# EAGLE design LEDs and Buttons (EAGLE 8.5.0)
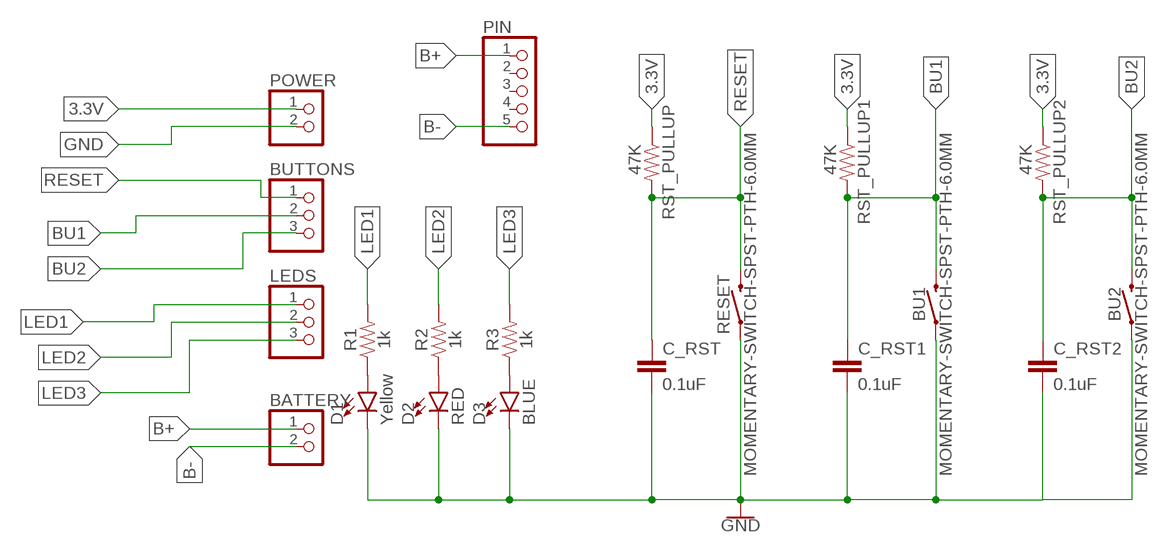
[diagram p0: schematic, sheet 1]

## Parts
BATTERY  PINHD-1X2  [1X02]
BU1  MOMENTARY-SWITCH-SPST-PTH-6.0MM  [TACTILE_SWITCH_PTH_6.0MM]
BU2  MOMENTARY-SWITCH-SPST-PTH-6.0MM  [TACTILE_SWITCH_PTH_6.0MM]
BUTTONS  PINHD-1X3  [1X03]
C_RST  0.1uF  22UF-0805-6.3V-20%  [0805]
C_RST1  0.1uF  22UF-0805-6.3V-20%  [0805]
C_RST2  0.1uF  22UF-0805-6.3V-20%  [0805]
D1  Yellow  LED-YELLOWLILYPAD  [LED-1206]
D2  RED  LED-RED1206  [LED-1206]
D3  BLUE  LED-BLUE1206  [LED-1206]
LEDS  PINHD-1X3  [1X03]
PIN  PINHD-1X55X2MM  [1_05X2MM]
POWER  PINHD-1X2  [1X02]
R1  1k  0.75OHM-0805-1/4W-1%  [0805]
R2  1k  0.75OHM-0805-1/4W-1%  [0805]
R3  1k  0.75OHM-0805-1/4W-1%  [0805]
RESET  MOMENTARY-SWITCH-SPST-PTH-6.0MM  [TACTILE_SWITCH_PTH_6.0MM]
RST_PULLUP  47K  RESISTOR0805  [0805]
RST_PULLUP1  47K  RESISTOR0805  [0805]
RST_PULLUP2  47K  RESISTOR0805  [0805]

## Nets
3.3V: POWER.1 RST_PULLUP1.1 RST_PULLUP2.1 RST_PULLUP.1
B+: BATTERY.1 PIN.1
B-: BATTERY.2 PIN.5
BU1: BU1.3 BUTTONS.2 C_RST1.1 RST_PULLUP1.2
BU2: BU2.3 BUTTONS.3 C_RST2.1 RST_PULLUP2.2
GND: BU1.1 BU2.1 C_RST1.2 C_RST2.2 C_RST.2 D1.C D2.C D3.C POWER.2 RESET.1
LED1: LEDS.1 R1.2
LED2: LEDS.2 R2.2
LED3: LEDS.3 R3.2
N$1: D1.A R1.1
N$2: D2.A R2.1
N$3: D3.A R3.1
RESET: BUTTONS.1 C_RST.1 RESET.3 RST_PULLUP.2
Unconnected: PIN.2 PIN.3 PIN.4

## Library data of the parts
BATTERY POWER = pinhead:PINHD-1X2: PIN HEADER
BU1 BU2 RESET = SparkFun-Switches:MOMENTARY-SWITCH-SPST: Momentary Switch (Pushbutton) - SPST Normally-open (NO) SPST momentary switches (buttons, pushbuttons). Variants PTH-12MM - 12mm square, through-hole Momentary Pushbutton Switch - 12mm Square <https://www.sparkfun.com/products/9190> (COM-09190) PTH-6.0MM, PTH-6.0MM-KIT - 6.0mm square, through-hole Mini Pushbutton Switch <https://www.sparkfun.com/products/97> (COM-00097) KIT package intended for soldering kit's - only one side of pads' copper is exposed. PTH-RIGHT-ANGLE-KIT - Right-angle, through-hole Right Angle Tactile Button <https://www.sparkfun.com/products/10791> - Used on SparkFun BigTime Watch Kit <https://www.sparkfun.com/products/11734> SMD-12MM - 12mm square, surface-mount Tactile Button - SMD (12mm) <https://www.sparkfun.com/products/12993> (COM-12993) Used on SparkFun PicoBoard <https://www.sparkfun.com/products/11888> SMD-4.5MM - 4.5mm Square Trackball Switch Used on SparkFun Blackberry Trackballer Breakout <https://www.sparkfun.com/products/13169> SMD-4.6MMX2.8MM - 4.60mm x 2.80mm, surface mount Used on SparkFun SAMD21 Mini Breakout <https://www.sparkfun.com/products/13664> SMD-5.2MM, SMD-5.2-REDUNDANT - 5.2mm square, surface-mount Mini Pushbutton Switch - SMD <https://www.sparkfun.com/products/8720> (COM-08720) Used on Arduino Pro Mini <https://www.sparkfun.com/products/11114> REDUNDANT package connects both switch circuits together SMD-6.0X3.5MM - 6.0 x 3.5mm, surface mount Momentary Reset Switch SMD <https://www.sparkfun.com/products/8229> (COM-08229) SMD-6.2MM-TALL - 6.2mm square, surface mount Tactile Button - SMD (6mm) <https://www.sparkfun.com/products/12992> Used on SparkFun Digital Sandbox <https://www.sparkfun.com/products/12651> SMD-RIGHT-ANGLE - Right-angle, surface mount Used on SparkFun Block for Intel® Edison - Arduino <https://www.sparkfun.com/products/13036>; PROD_ID: SWCH-08441; SF_SKU: COM-00097
BUTTONS LEDS = pinhead:PINHD-1X3: PIN HEADER
C_RST C_RST1 C_RST2 = SparkFun-Capacitors:22UF: 22µF ceramic capacitors A capacitor is a passive two-terminal electrical component used to store electrical energy temporarily in an electric field.; PROD_ID: CAP-08402; VALUE: 22uF
D1 = SparkFun-LED:LED-YELLOW: Yellow SMD LED Used in manufacturing several products at SparkFun. Packages: 0603 - SMD 0603 package[Product Link] <http://www.kingbrightusa.com/product.asp?catalog_name=LED&product_id=APT1608SYCK> 0603 -SMART - SMART SMD 0603 package (more efficient/more expensive) [Product Link] <http://www.osram-os.com/osram_os/en/products/product-catalog/led-light-emitting-diodes/smartled-0603/ly-l29k/index.jsp> LilyPad - SMD1206 package[Product Datasheet] <https://www.sparkfun.com/datasheets/DevTools/LilyPad/Q150YUS4.pdf> SparkFun Products: Blynk Board <https://www.sparkfun.com/products/13794> IOIO-OTG <https://www.sparkfun.com/products/13613> XBee Explorer Serial <https://www.sparkfun.com/products/13225>; PROD_ID: DIO-09909
D2 = SparkFun-LED:LED-RED: Red SMD LED Used in manufacturing of most products at SparkFun Packages: 0603 - SMD 0603 package [Product Link] <http://docs.avagotech.com/docs/AV02-0551EN> 0603 SMART - SMD 0603 SMART package ( more efficient and expensive)[Product Link] <http://www.osram-os.com/Graphics/XPic2/00077099_0.pdf> 1206 - SMD1206 package [Product Link] <https://www.sparkfun.com/datasheets/DevTools/LilyPad/Q150OVS4.pdff> SparkFun Products: Pro Mini 328 -5V <https://www.sparkfun.com/products/821> RedBoard <https://www.sparkfun.com/products/12757> IOIO-OTG <https://www.sparkfun.com/products/13613>; PROD_ID: DIO-09912
D3 = SparkFun-LED:LED-BLUE: Blue SMD LED Used in manufacturing of various products at SparkFun Packages: 0603 - SMD 0603 package [Product Link] <http://www.digikey.com/product-detail/en/SMLE12BC7TT86/511-1589-2-ND/1641808> 1206 - SMD1206 package [Product Link] <http://www.digikey.com/product-detail/en/lite-on-inc/LTST-C150TBKT/160-1643-1-ND/573584> SparkFun Products: ESP8266 Thing-Dev Board <https://www.sparkfun.com/products/13711> RedBoard <https://www.sparkfun.com/products/12757>; PROD_ID: DIO-09911
PIN = pinhead:PINHD-1X5: PIN HEADER
R1-R3 = SparkFun-Resistors:0.75OHM: 0.75Ω resistor A resistor is a passive two-terminal electrical component that implements electrical resistance as a circuit element. Resistors act to reduce current flow, and, at the same time, act to lower voltage levels within circuits. - Wikipedia; PROD_ID: RES-08474; VALUE: 0.75
RST_PULLUP RST_PULLUP1 RST_PULLUP2 = SparkFun-Resistors:RESISTOR: Generic Resistor Package

## Board
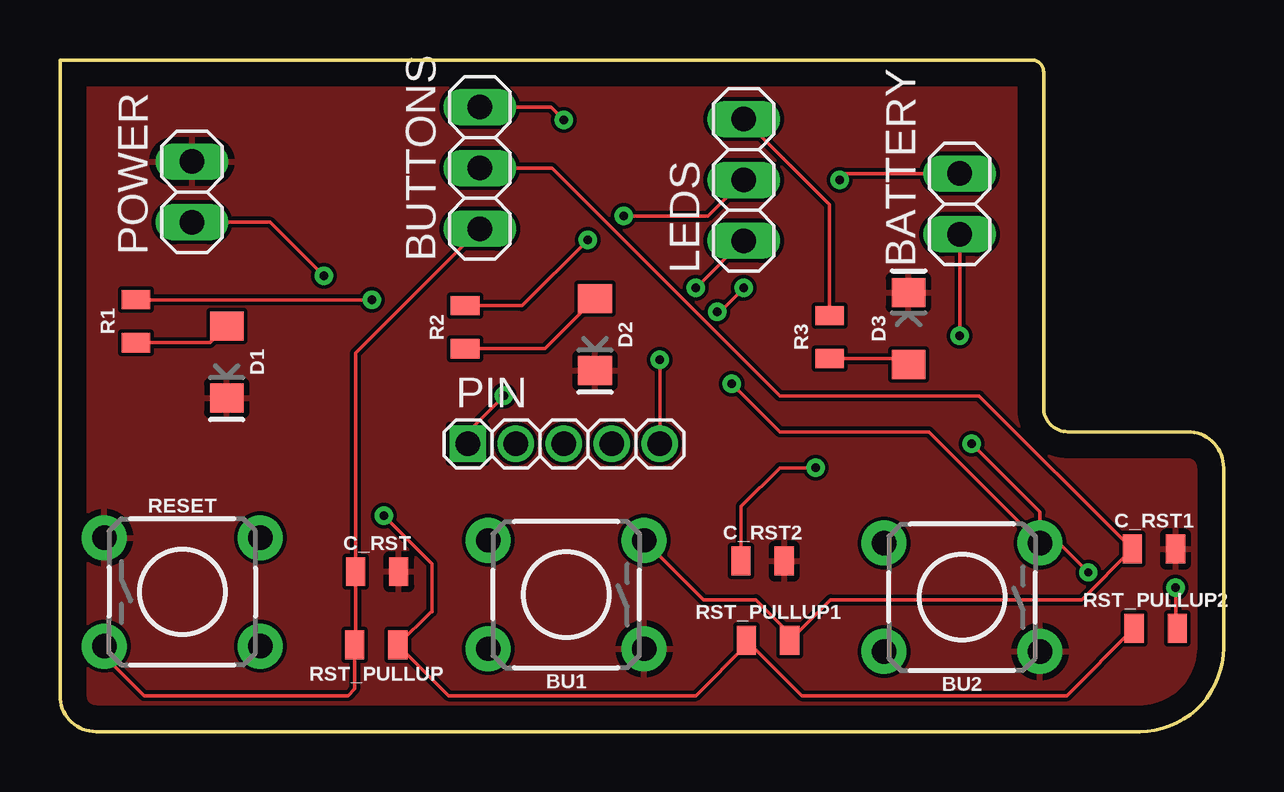
[diagram p1: board, top side]
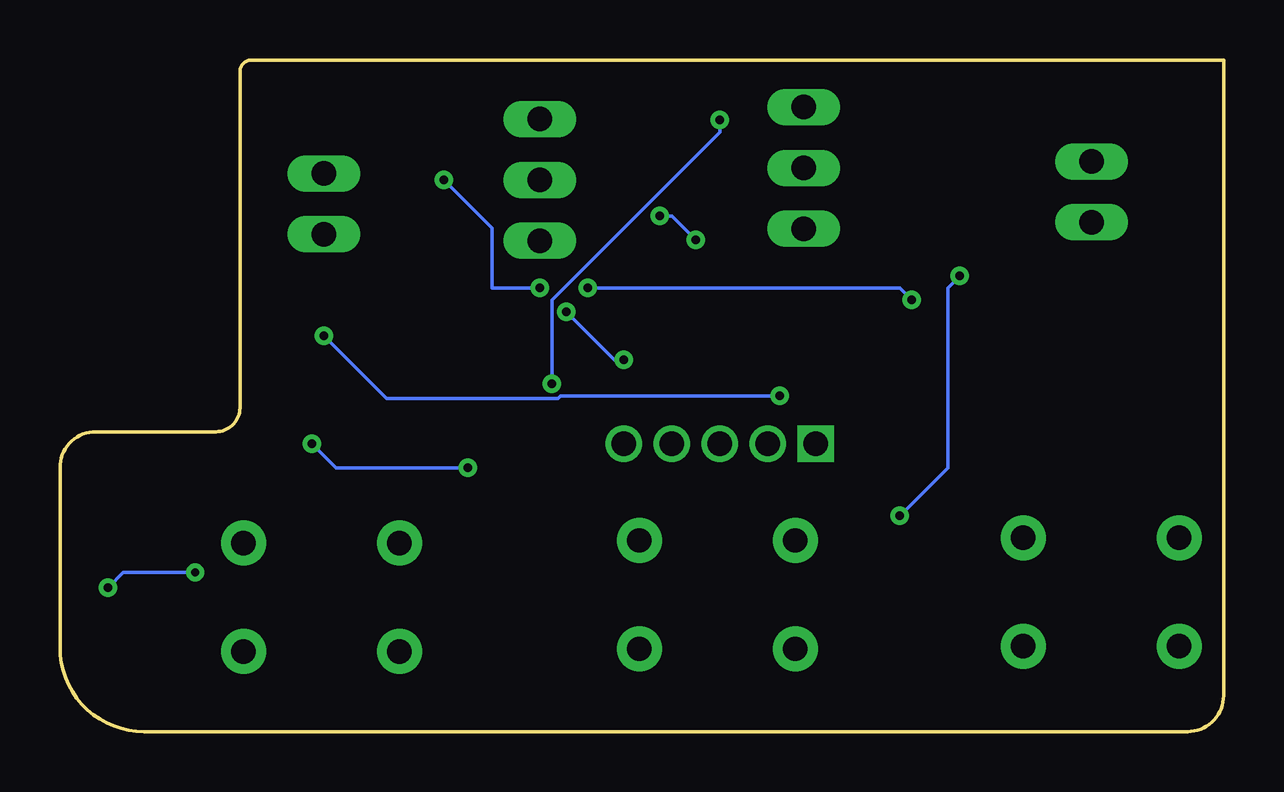
[diagram p2: board, bottom side, seen from below]

Size 48.5 x 28 mm. Coordinates in mm from the lower left corner, seen from the top.
Outline: 0,28 0,1.5 arc90 1.5,0 45,0 arc90 48.5,3.5 48.5,11 arc90 47,12.5 42,12.5 arc-90 41,13.5 41,27.5 arc90 40.5,28 0,28
Copper layers (1*16): Top 0.035mm / dielectric 1.5mm / Bottom 0.035mm
Design rules "default": minimum track width 6mil, minimum drill 0.35mm, track to track 6mil, track to pad 6mil, pad to pad 6mil, via to via 6mil, smd to smd 6mil, copper to edge 40mil, drill to drill 6mil, minimum pad ring 10mil, minimum via ring 8mil, stop-mask expansion 4mil, vias tented up to drill 0mil, thermal gap 10mil

### Footprints (pad centres in the part's own frame; a part is rotated, then mirrored left to right if it is on the bottom)
1X02 = drill 1.016 long: 1 -1.27,0; 2 1.27,0
TACTILE_SWITCH_PTH_6.0MM = drill 1.016 pad 1.88: 1 -3.251,2.261; 2 3.251,2.261; 3 -3.251,-2.261; 4 3.251,-2.261
1X03 = drill 1.016 long: 1 -2.54,0; 2 0,0; 3 2.54,0
0805 = smd 0.8 x 1.2: 1 -0.9,0; 2 0.9,0
LED-1206 = smd 1.2 x 1.4: A -1.5,0; C 1.5,0
1_05X2MM = drill 1.016 pad 1.3 square: 1 -4,0 | drill 1.016 pad 1.3: 2 -2,0; 3 0,0; 4 2,0; 5 4,0

### Placement (x,y rotation side)
BATTERY  37.5,22 90 top
BU1  21.1,5.71 180 top
BU2  37.6,5.6 180 top
BUTTONS  17.5,23.5 90 top
C_RST  13.22,6.67 0 top
C_RST1  45.6,7.61 0 top
C_RST2  29.29,7.11 0 top
D1  6.95,15.41 270 top
D2  22.3,16.55 270 top
D3  35.37,16.8 90 top
LEDS  28.5,23 90 top
PIN  21,12 0 top
POWER  5.5,22.5 90 top
R1  3.17,17.11 90 top
R2  16.89,16.86 90 top
R3  32.08,16.45 90 top
RESET  5.1,5.82 0 top
RST_PULLUP  13.18,3.61 180 top
RST_PULLUP1  29.52,3.8 0 top
RST_PULLUP2  45.67,4.3 0 top

### Tracks (layer width: path | path; a pad name or v marks a point on that pad's centre or on a via)
3.3V  (via drill 0.35)
  Top 0.152: RST_PULLUP2.1 41.97,1.5 30.92,1.5 RST_PULLUP1.1 28.62,3.62 26.5,1.5 16.19,1.5 RST_PULLUP.1 15.47,5 15.5,5 15.5,7 v13.5,9 | v11,19 8.77,21.23 POWER.1
  Bottom 0.152: v13.5,9 11.5,11 11.5,18.5 v11,19
B+  (via drill 0.35)
  Top 0.152: BATTERY.1 v37.5,16.5 | v18.5,14 17,12.5 PIN.1
  Bottom 0.152: v18.5,14 27.64,14 27.75,13.89 34.89,13.89 v37.5,16.5
B-  (via drill 0.35)
  Top 0.152: BATTERY.2 32.77,23.27 v32.5,23 | v28.5,18.5 27.5,17.5 v27.39,17.5 | v25,15.5 PIN.5
  Bottom 0.152: v32.5,23 30.5,21 30.5,18.5 v28.5,18.5 | v27.39,17.5 25.39,15.5 v25,15.5
BU1
  Top 0.152: BU1.3 26.82,5.5 29,5.5 30.42,4.08 RST_PULLUP1.2 32.12,5.5 42.59,5.5 C_RST1.1 38.31,14 30,14 20.5,23.5 BUTTONS.2
BU2  (via drill 0.35)
  Top 0.152: BU2.3 36.21,12.5 30,12.5 v28,14.5 | v21,25.5 20.46,26.04 BUTTONS.3 | BU2.3 40.85,9.15 v38,12 | v31.5,11 30,11 28.39,9.39 C_RST2.1 | BU2.3 41.64,7.86 v42.87,6.63 | v46.5,6 46.5,4.37 RST_PULLUP2.2
  Bottom 0.152: v28,14.5 28,18 21,25 v21,25.5 | v38,12 37,11 v31.5,11 | v42.87,6.63 45.87,6.63 v46.5,6
GND
  pour Top: 0.5,26.5 0.5,0.5 48.5,0.5 48.5,28 0.5,28
LED1  (via drill 0.35)
  Top 0.152: v26.5,18.5 28.46,20.46 LEDS.1 | R1.2 v13,18
  Bottom 0.152: v13,18 13.5,18.5 v26.5,18.5
LED2  (via drill 0.35)
  Top 0.152: 22,20.35 v22,20.5 19.26,17.76 R2.2 | LEDS.2 27,21.5 v23.5,21.5
  Bottom 0.152: v22,20.5 23,21.5 v23.5,21.5
LED3
  Top 0.152: LEDS.3 32.08,21.96 R3.2
N$1
  Top 0.152: R1.1 6.25,16.21 D1.A
N$2
  Top 0.152: R2.1 20.21,15.96 D2.A
N$3
  Top 0.152: R3.1 35.12,15.55 D3.A
RESET
  Top 0.152: RESET.3 1.85,3.15 3.5,1.5 12,1.5 12.28,1.78 RST_PULLUP.2 12.32,3.65 C_RST.1 12.32,15.78 BUTTONS.1